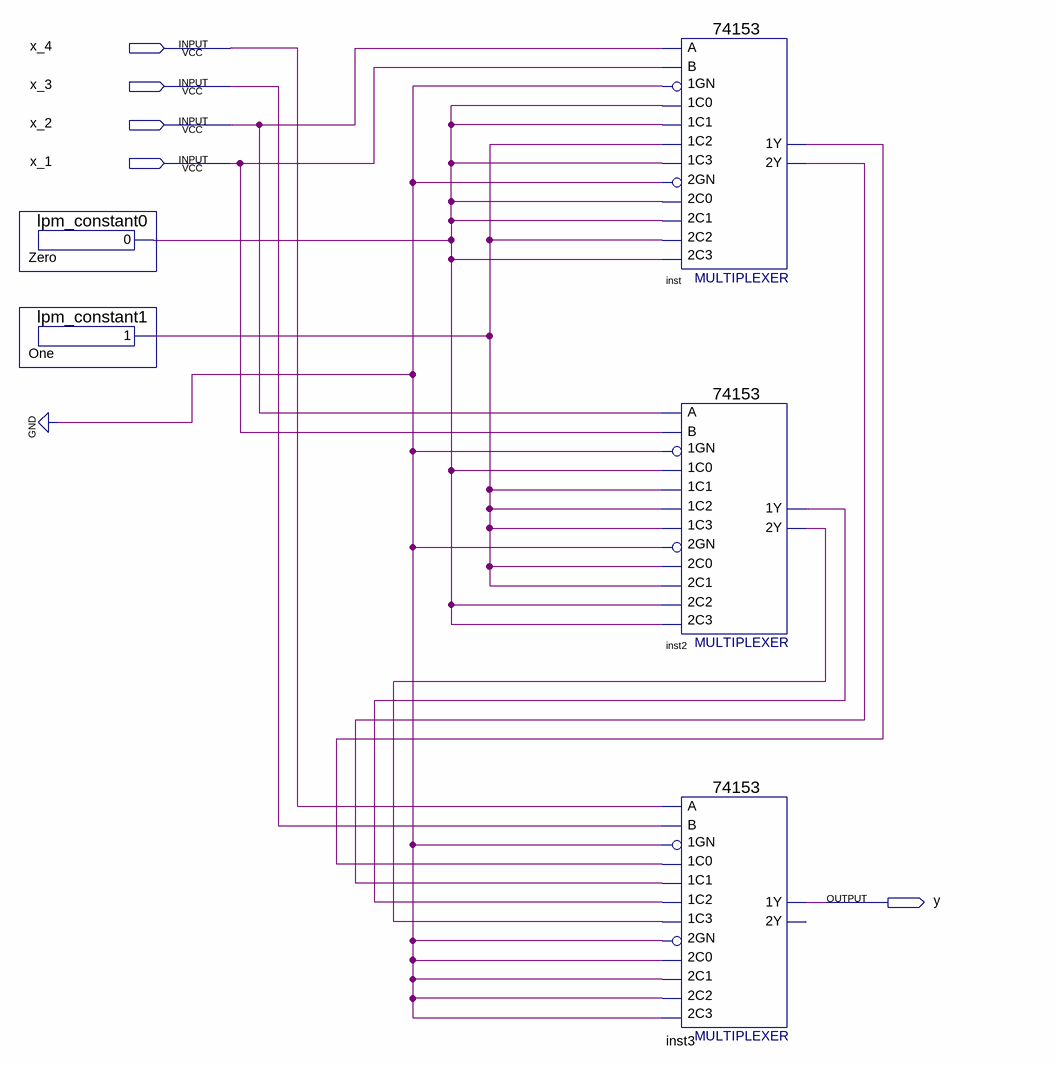
[diagram p0: schematic sheet]
// Quartus schematic Practice_work_2_project.bdf as structural Verilog: 5 symbols, 5 pins
module Practice_work_2_project (
  input  x_4,
  input  x_3,
  input  x_2,
  input  x_1,
  output y
);

  wire inst2_1y, inst2_2y, inst_1y, inst_2y, One_result, Zero_result;

  lpm_constant0 Zero (.result(Zero_result));
  lpm_constant1 One (.result(One_result));
  \74153  inst (
    .\1C1 (Zero_result), .\1GN (1'b0), .\1C0 (Zero_result), .\2C0 (Zero_result), .\2GN (1'b0),
    .\2C2 (One_result), .\1C2 (One_result), .\1C3 (Zero_result), .B(x_1), .A(x_2), .\2C1 (Zero_result),
    .\2C3 (Zero_result), .\1Y (inst_1y), .\2Y (inst_2y));
  \74153  inst2 (
    .\1C1 (One_result), .\1GN (1'b0), .\1C0 (Zero_result), .\2C0 (One_result), .\2GN (1'b0),
    .\2C2 (Zero_result), .\1C2 (One_result), .\1C3 (One_result), .B(x_1), .A(x_2), .\2C1 (One_result),
    .\2C3 (Zero_result), .\1Y (inst2_1y), .\2Y (inst2_2y));
  \74153  inst3 (
    .\1C1 (inst_2y), .\1GN (1'b0), .\1C0 (inst_1y), .\2C0 (1'b0), .\2GN (1'b0), .\2C2 (1'b0),
    .\1C2 (inst2_1y), .\1C3 (inst2_2y), .B(x_3), .A(x_4), .\2C1 (1'b0), .\2C3 (1'b0), .\1Y (y));  // open: 2Y
endmodule
